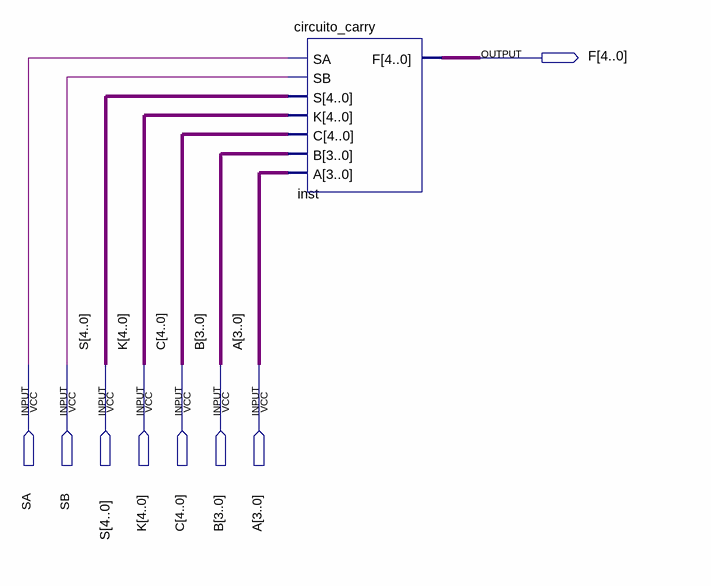
[diagram p0: schematic sheet]
// Quartus schematic circuito_decisao_final.bdf as structural Verilog: 1 symbols, 8 pins
module circuito_decisao_final (
  input  SA,
  input  SB,
  input  [4:0] S,
  input  [4:0] K,
  input  [4:0] C,
  input  [3:0] B,
  input  [3:0] A,
  output [4:0] F
);

  circuito_carry inst (.SA(SA), .SB(SB), .S(S), .K(K), .C(C), .B(B), .A(A), .F(F));
endmodule
